# Altium schematic sheet Zillion.SchDoc: Zillion - Z80 Single Board Computer
size A4; Author: Francesco Sacco; Revision: 0; ProjectName: Zillion - Z80 Single Board Computer
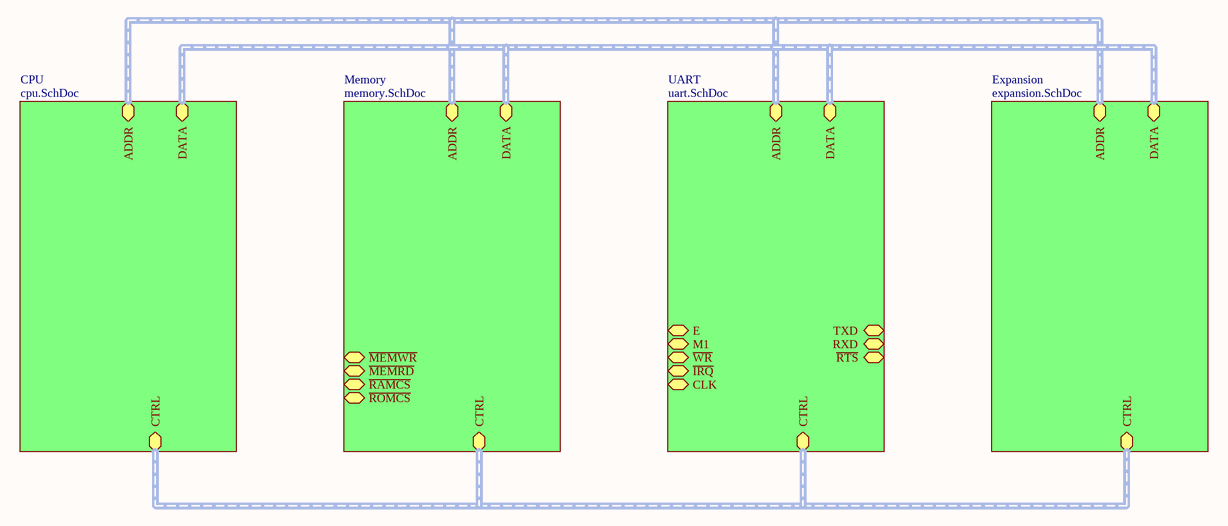
[diagram p0: Zillion.SchDoc]

## Sub-sheets
CPU = cpu.SchDoc: ADDR (harness ADDR), DATA (harness DATA), CTRL (harness CTRL)
Expansion = expansion.SchDoc: ADDR (harness ADDR), DATA (harness DATA), CTRL (harness CTRL)
Memory = memory.SchDoc: ADDR (harness ADDR), DATA (harness DATA), CTRL (harness CTRL), ~{MEMWR}, ~{MEMRD}, ~{RAMCS}, ~{ROMCS}
UART = uart.SchDoc: ADDR (harness ADDR), DATA (harness DATA), CTRL (harness CTRL), E, M1, ~{WR}, ~{IRQ}, CLK, ~{RTS}, TXD, RXD

## Buses and harness runs
harness sheet CPU/ADDR = sheet Expansion/ADDR = sheet Memory/ADDR = sheet UART/ADDR
harness sheet CPU/CTRL = sheet Expansion/CTRL = sheet Memory/CTRL = sheet UART/CTRL
harness sheet CPU/DATA = sheet Expansion/DATA = sheet Memory/DATA = sheet UART/DATA